# EAGLE design reload (EAGLE 6.4)
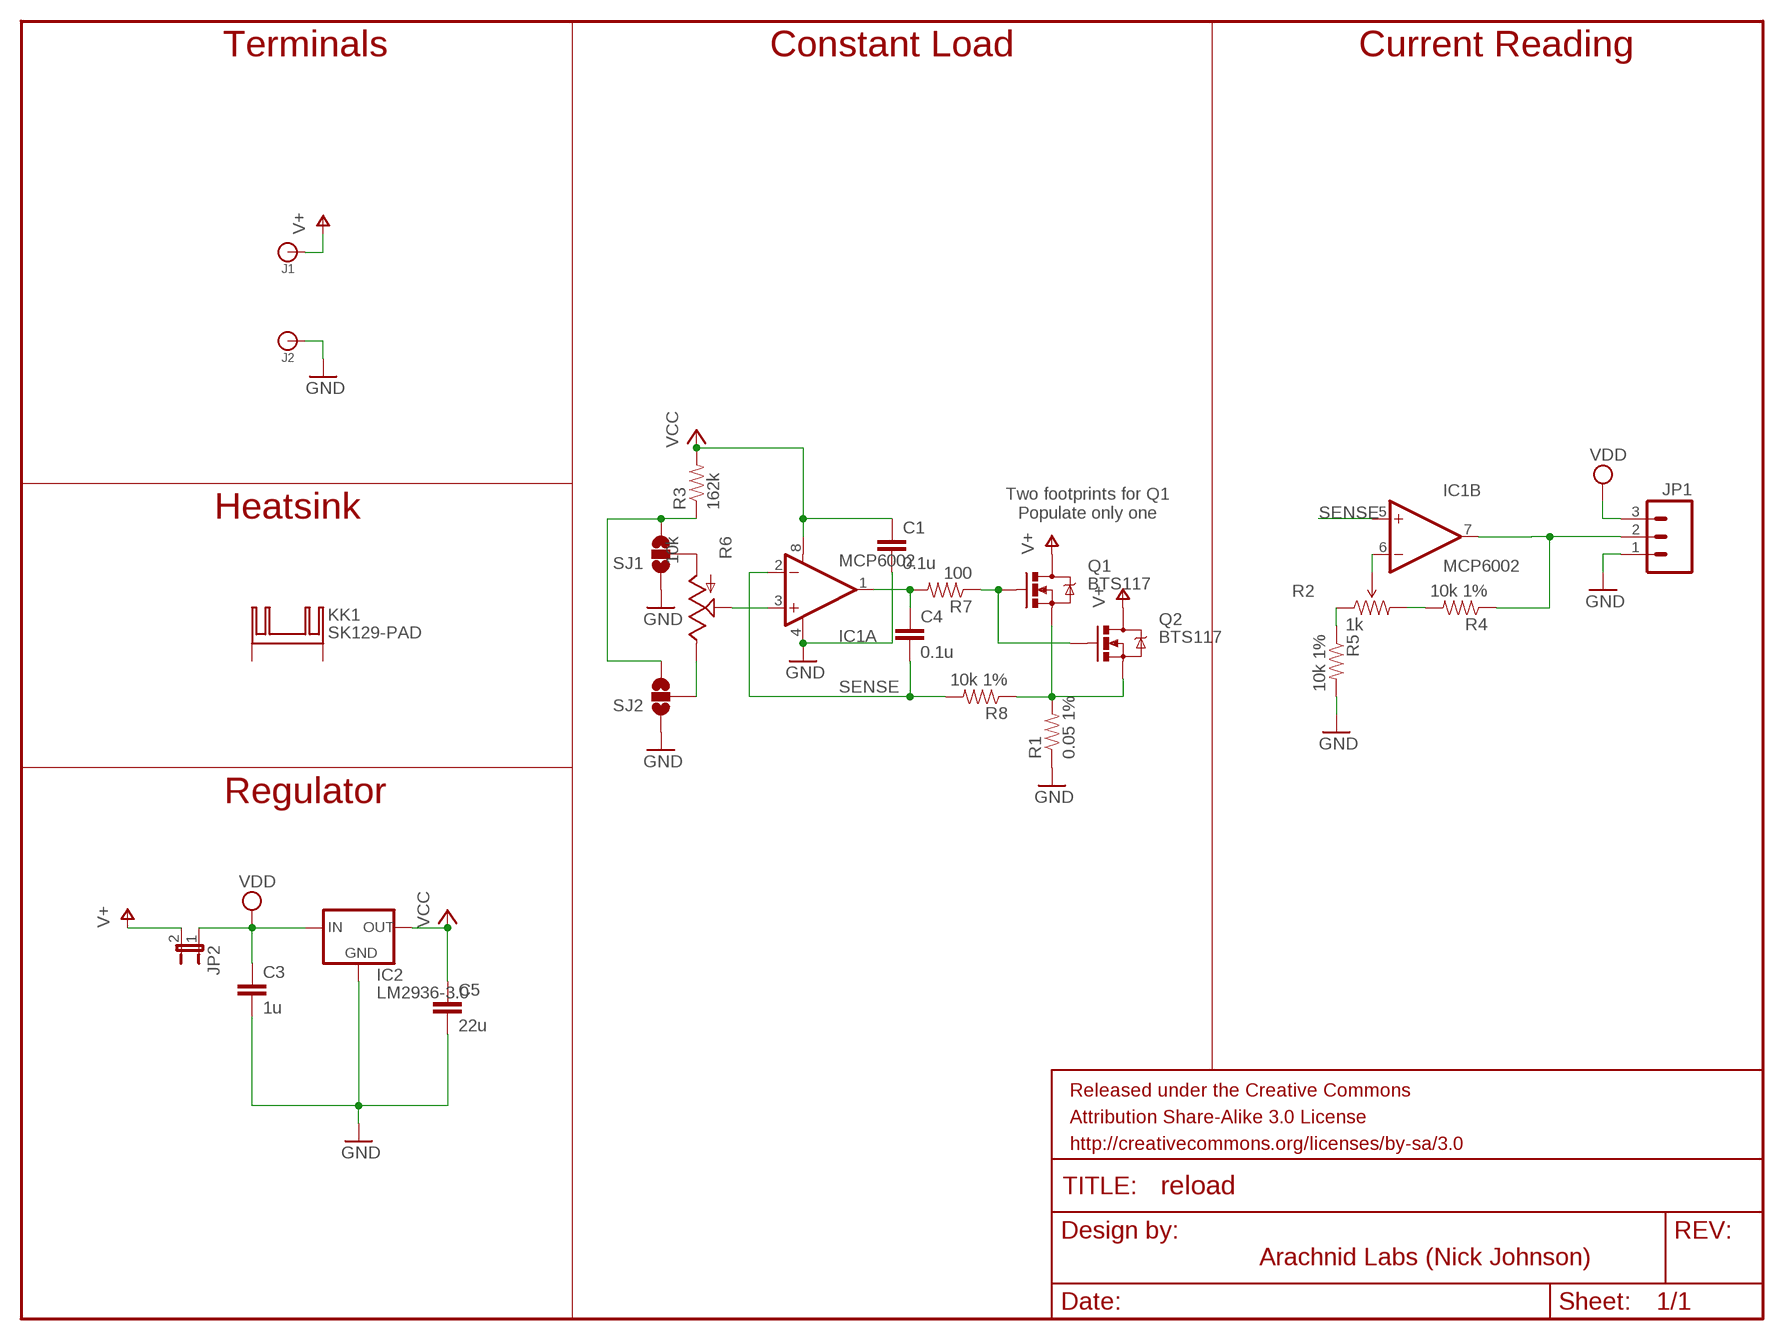
[diagram p0: schematic, sheet 1]

## Parts
C1  0.1u  CAP0805  [0805]
C3  1u  CAP0805  [0805]
C4  0.1u  CAP0805  [0805]
C5  22u  CAP0805  [0805]
IC1  MCP6002  OPAMP-DUALMS  [SOP08]
IC2  LM2936-3.0  V_REG_MIC2920  [SOT223]
J1  BANANA_CONN  [BANANA_CONN]
J2  BANANA_CONN  [BANANA_CONN]
JP1  M031X03_NO_SILK  [1X03_NO_SILK]
JP2  JUMPER-2SMD-NC  [SJ_2S]
KK1  SK129-PAD  [SK129]
Q1  BTS117  MOSFET-NCHANNELPTH2  [TO220V]
Q2  BTS117  MOSFET-NCHANNELTO220V-NOSILK  [TO220V-NOSILK]
R1  0.05 1%  RESISTOR2512  [R2512]
R2  1k  TRIMPOTEVN5E  [TRIMPOT-EVN5E]
R3  162k  RESISTOR0805-RES  [0805]
R4  10k 1%  RESISTOR0805-RES  [0805]
R5  10k 1%  RESISTOR0805-RES  [0805]
R6  10k  POT  [ALPS_POT]
R7  100  RESISTOR0805-RES  [0805]
R8  10k 1%  RESISTOR0805-RES  [0805]
SJ1  SOLDERJUMPER_2WAYPASTE2&3  [SJ_3_PASTE2&3]
SJ2  SOLDERJUMPER_2WAYPASTE1&2  [SJ_3_PASTE1&2]

## Nets
GND: C1.2 C3.2 C5.2 IC1.4(A:V-) IC2.2(GND) J2.P$1 JP1.1 R1.1 R5.2 SJ1.1 SJ2.1
IREF: IC1.7(B:OUT) JP1.2 R4.1
N$1: C4.1 IC1.1(A:OUT) R7.2
N$2: R6.P$3(A) SJ1.2
N$3: Q1.3(S) Q2.3(S) R1.2 R8.1
N$4: IC1.3(A:+IN) R6.P$2(S)
N$5: IC1.6(B:-IN) R2.2(WIPER)
N$6: R2.1(CCW) R5.1
N$7: R2.3(CW) R4.2
N$8: R6.P$1(E) SJ2.2
N$9: Q1.1(G) Q2.1(G) R7.1
N$10: R3.1 SJ1.3 SJ2.3
SENSE: C4.2 IC1.2(A:-IN) IC1.5(B:+IN) R8.2
V+: J1.P$1 JP2.2 Q1.2(D) Q2.2(D)
VCC: C1.1 C5.1 IC1.8(A:V+) IC2.3(OUT) R3.2
VDD: C3.1 IC2.1(IN) JP1.3 JP2.1
Unconnected: KK1.A2,5(K) KK1.B2,5(K)

## Notes on the sheet
- Terminals | Constant Load | Current Reading
- Heatsink
- Two footprints for Q1
  Populate only one
- Regulator
- Arachnid Labs (Nick Johnson)

## Library data of the parts
C1 C3-C5 = SparkFun-Passives:CAP: Capacitor Standard 0603 ceramic capacitor, and 0.1" leaded capacitor.
IC1 = nickparts:OPAMP-DUAL: Generic op-amp footprint
IC2 = SparkFun-PowerIC:V_REG_MIC2920: MIC2920A (http://www.micrel.com/_PDF/mic2920.pdf) - 400mA output LDO Regulator
J1 J2 = SparkFun-Connectors:BANANA_CONN: Through-hole banana jack
JP1 = SparkFun-Connectors:M03: Header 3 Standard 3-pin 0.1" header. Use with straight break away headers (SKU : PRT-00116), right angle break away headers (PRT-00553), swiss pins (PRT-00743), machine pins (PRT-00117), and female headers (PRT-00115). Molex polarized connector foot print use with SKU : PRT-08232 with associated crimp pins and housings.
JP2 = SparkFun-Passives:JUMPER-2: Jumper Basic 0.1" spaced jumper. Use with breakaway headers.
KK1 = nickparts:SK129-PAD: HEATSINK manufacturer Fischer/distributor Buerklin
Q1 = SparkFun-DiscreteSemi:MOSFET-NCHANNEL: Generic NMOS footprint
Q2 = nickparts:MOSFET-NCHANNEL: Common NMOSFET Parts MFG P/N Store ID Prod ID FDD8780 TRANS-09984 SI7820DN TRANS-11055 FDS6630A IC-08089 2N7002PW TRANS-11151 FQP30N06L COM-10213 TRANS-10060 BSS123LT1G TRANS-08345 BSS138 TRANS-00830 BS170 2N7000
R1 R3-R5 R7 R8 = SparkFun-Passives:RESISTOR: Resistor Basic schematic elements and footprints for 0603, 1206, and PTH resistors.
R2 = nickparts:TRIMPOT: Various small potentiometers for "set-and-forget" applications
R6 = nickparts:POT
SJ1 SJ2 = SparkFun-Passives:SOLDERJUMPER_2WAY: Solder Jumper 2 way solder jumper

## Board
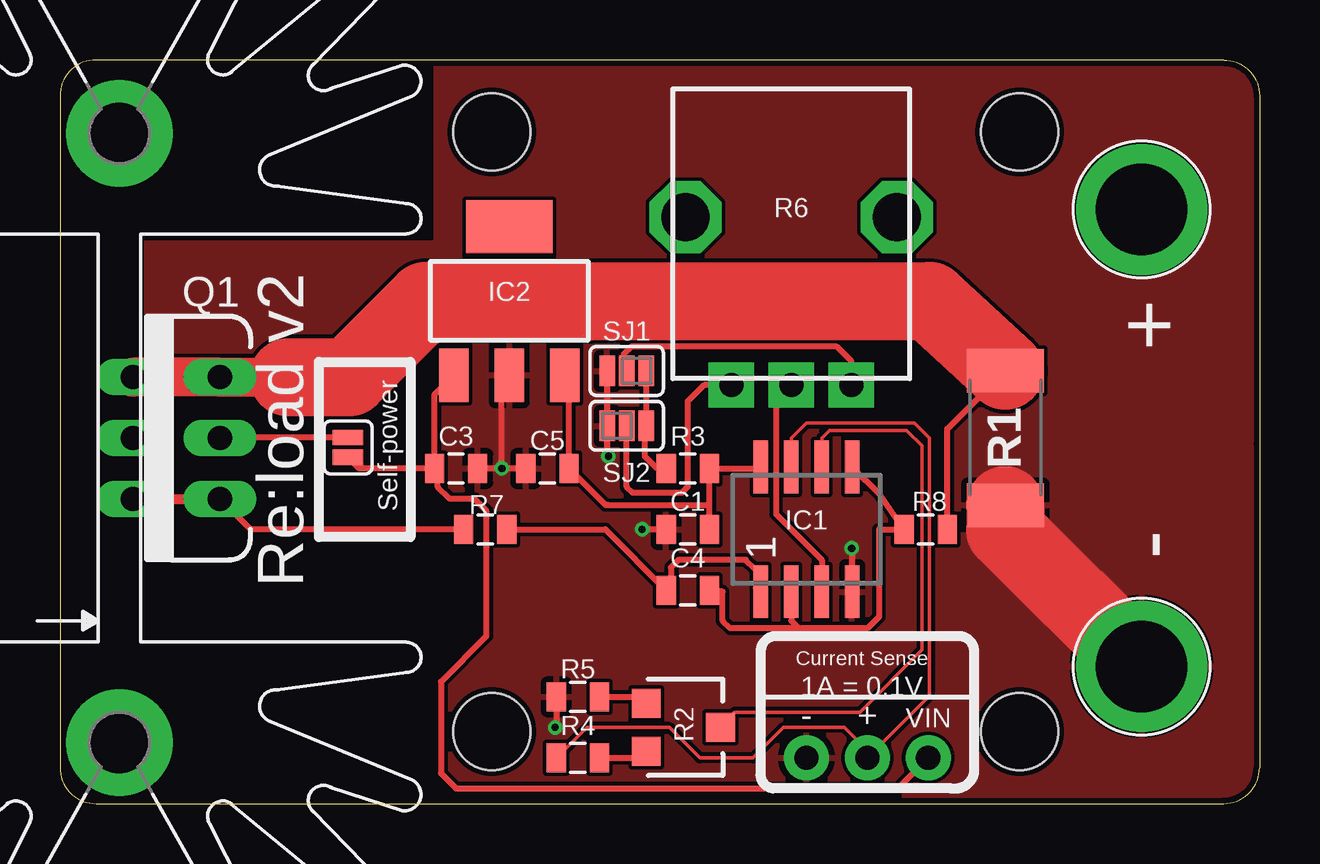
[diagram p1: board, top side]
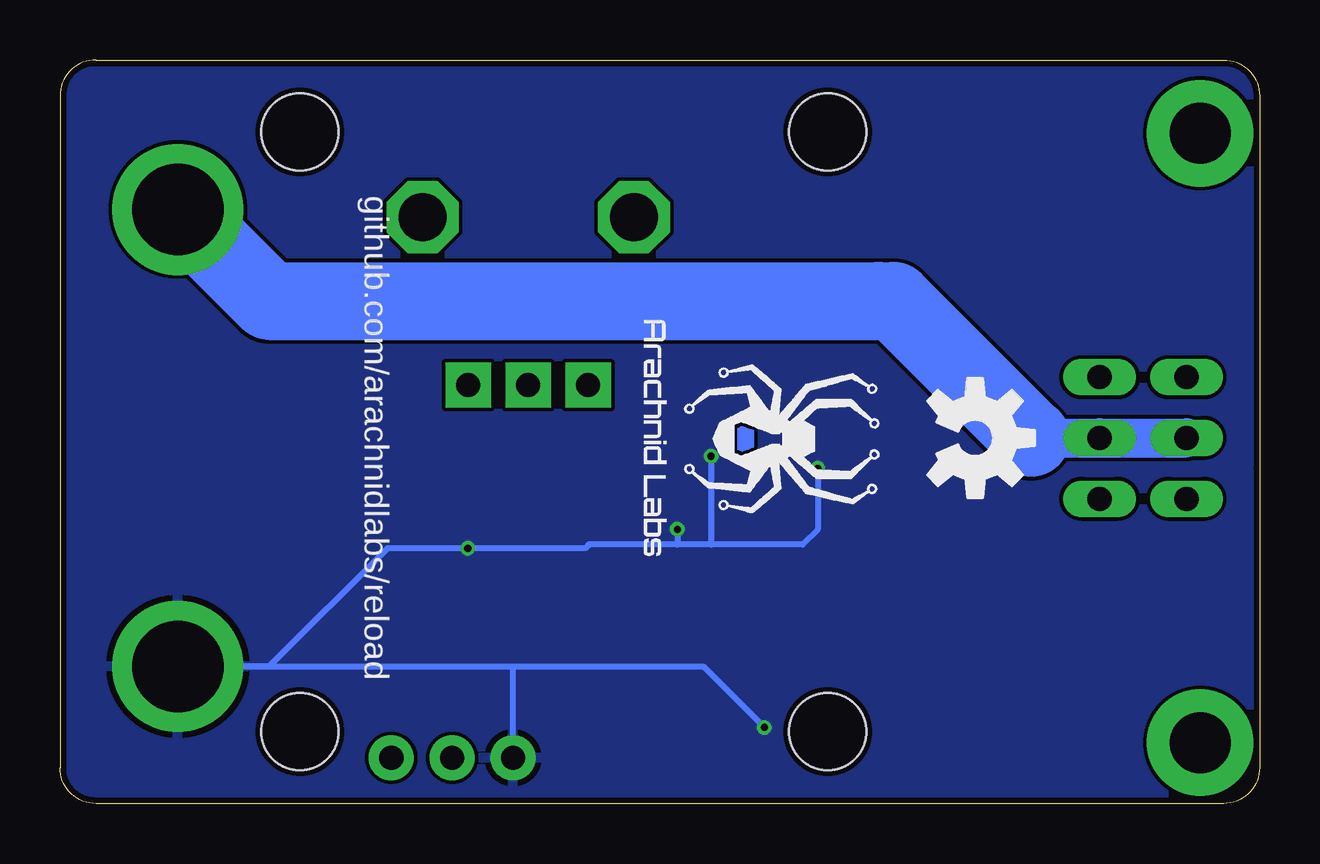
[diagram p2: board, bottom side, seen from below]

Size 50 x 31 mm. Coordinates in mm from the lower left corner, seen from the top.
Outline: 0,1.5 arc90 1.5,0 48.5,0 arc90 50,1.5 50,15 50,29.5 arc90 48.5,31 1.5,31 arc90 0,29.5 0,14 0,1.5
Copper layers (1*16): Top 0.035mm / dielectric 1.5mm / Bottom 0.035mm
Design rules "Fusion_eagle_rule_v1.1 *": minimum track width 6mil, minimum drill 0.3mm, track to track 6mil, track to pad 6mil, pad to pad 6mil, via to via 6mil, smd to smd 0mil, copper to edge 10mil, drill to drill 10mil, minimum pad ring 10mil, minimum via ring 6mil, stop-mask expansion 2mil, vias tented up to drill 100mil, thermal gap 10mil
Holes 3.2 mm at 18,28 18,3 40,28 40,3

### Footprints (pad centres in the part's own frame; a part is rotated, then mirrored left to right if it is on the bottom)
0805 = smd 0.8 x 1.2: 1 -0.9,0; 2 0.9,0
SOP08 = smd 0.6 x 2.2: 1 -1.905,-2.6; 2 -0.635,-2.6; 3 0.635,-2.6; 4 1.905,-2.6; 5 1.905,2.6; 6 0.635,2.6; 7 -0.635,2.6; 8 -1.905,2.6
SOT223 = smd 1.219 x 2.235: 1 -2.311,-3.099; 2 0,-3.099; 3 2.311,-3.099 | smd 3.6 x 2.2: 4 0,3.099
BANANA_CONN = drill 3.81 pad 5.461: P$1 0,0
1X03_NO_SILK = drill 1.016 pad 1.88: 1 0,0; 2 2.54,0; 3 5.08,0
SJ_2S = smd 0.635 x 1.27: 1 -0.412,0; 2 0.412,0
SK129 = drill 2.54 pad 4.445: A2,5 -12.7,-0.889; B2,5 12.7,-0.889
TO220V = drill 1.016 long: 1 -2.54,0; 2 0,0; 3 2.54,0
TO220V-NOSILK = drill 1.016 long: 1 -2.54,0; 2 0,0; 3 2.54,0
R2512 = smd 1.8 x 3.2: 1 -2.8,0; 2 2.8,0
TRIMPOT-EVN5E = smd 1.2 x 1.2: 1 -1,-1.6; 2 0,1.5; 3 1,-1.6
ALPS_POT = drill 1 pad 1.88 square: P$1 7,-2.5; P$2 7,0; P$3 7,2.5 | drill 2 octagon: P$4 0,-4.4; P$5 0,4.4
SJ_3_PASTE2&3 = smd 0.635 x 1.27: 1 -0.813,0; 2 0,0; 3 0.813,0
SJ_3_PASTE1&2 = smd 0.635 x 1.27: 1 -0.813,0; 2 0,0; 3 0.813,0

### Placement (x,y rotation side)
C1  26.17,11.43 180 top
C3  16.51,13.97 0 top
C4  26.17,8.89 0 top
C5  20.32,13.97 180 top
IC1  31.11,11.43 0 top
IC2  18.73,20.95 0 top
J1  45.09,24.77 0 top
J2  45.09,5.71 0 top
JP1  31.11,1.91 0 top
JP2  12.01,14.85 90 top
KK1  1.59,15.24 90 top
Q1  6.67,15.24 90 top
Q2  3.05,15.24 90 top
R1  39.4,15.24 90 top
R2  26.04,3.17 270 top
R3  26.17,13.97 0 top
R4  21.59,1.91 0 top
R5  21.59,4.45 180 top
R6  30.48,24.45 270 top
R7  17.73,11.43 0 top
R8  36.08,11.43 180 top
SJ1  23.62,18.03 0 top
SJ2  23.62,15.75 0 top
U$2  [ARACHNID_LABS_LOGO_SM]  20.75,15.24 270 bottom
U$3  [OSHW-LOGO-M]  11.86,15.24 270 bottom

### Tracks (layer width: path | path; a pad name or v marks a point on that pad's centre or on a via)
GND  (via drill 0.3)
  Top 0.254: 33.02,9.68 IC1.4 33,8.98 v33,10.64 | R5.2 20.69,3.23 v20.64,3.17 | v18.41,13.97 C3.2 | C5.2 v18.41,13.97 | C1.2 v24.27,11.43 | 22.86,17.78 22.75,17.89 SJ1.1 SJ2.1 22.81,14.53 v22.86,14.48 | v18.41,13.97 18.41,17.54 IC2.2
  Top 3.251: R1.1 39.41,11.39 J2.P$1
  Bottom 0.254: 31.11,5.71 J2.P$1 41.27,5.71 36.35,10.64 v33,10.64 28.1,10.64 27.98,10.76 27.98,10.79 24.27,10.79 | 31.11,5.71 23.18,5.71 v20.64,3.17 | JP1.1 31.11,5.71 | v18.41,13.97 18.41,11.43 19.05,10.79 22.86,10.79 | 22.86,10.79 24.27,10.79 | v24.27,11.43 24.27,10.79 | v22.86,14.48 22.86,10.79
  pour Bottom: 0,31 49,31 arc-90 50,30 50,0 0.41,0 arc-90 0,0.41
  pour Top: 0,0 50,0 50,31 0,31
IREF
  Top 0.152: IC1.7 30.48,15.24 31.11,15.88 35.61,15.88 36.24,15.24 36.24,4.49 JP1.2 33.66,2.22 32.7,3.17 30.16,3.17 28.89,1.91 26.67,1.91 25.4,3.17 21.96,3.17 R4.1
N$1
  Top 0.254: IC1.1 29,8.98 29,9.73 28.57,10.16 25.79,10.16 25.47,9.84 25.47,8.94 C4.1 22.73,11.43 R7.2
N$2
  Top 0.254: R6.P$3 32.98,18.45 32.7,18.73 32.38,19.05 23.81,19.05 23.5,18.73 23.5,18.07 SJ1.2
N$3
  Top 0.254: R8.1 36.98,15.62 R1.2
  Top 1.626: 9.53,17.78 Q1.3 Q2.3
  Top 3.251: 9.53,17.78 12.06,17.78 15.24,20.95 36.24,20.95 R1.2
N$4
  Top 0.254: R6.P$2 30.48,17.14 29.84,16.51 29.84,12.06 31.75,10.16 IC1.3
N$5
  Top 0.152: 27.73,3.17 R2.2 28.12,3.81 33.34,3.81 35.92,6.4 35.92,14.92 35.29,15.56 32.07,15.56 31.75,15.24 IC1.6
N$6
  Top 0.254: 24.66,4.33 R2.1 23.96,4.45 R5.1
N$7
  Top 0.254: R2.3 24.66,2.33 | 24.32,2.22 R2.3 | R4.2 23.96,1.91 R2.3
N$8
  Top 0.254: R6.P$1 26.85,17.45 26.16,16.76 26.16,13.21 25.91,12.95 23.88,12.95 23.62,13.21 23.62,15.7 SJ2.2
N$9
  Top 0.254: R7.1 7.94,11.43 Q1.1
  Top 0.406: Q2.1 Q1.1
N$10
  Top 0.254: SJ1.3 SJ2.3 24.38,15.75 24.38,14.48 24.89,13.97 R3.1
SENSE
  Top 0.254: IC1.5 34.18,12.88 R8.2 34.14,11.44 34.14,7.79 33.66,7.3 30.8,7.3 | 30.8,7.3 27.94,7.3 27.62,7.62 27.62,8.84 C4.2 | IC1.2 30.48,7.62 30.8,7.3
V+
  Top 0.254: JP2.2 6.68,15.26 Q1.2
  Bottom 0.254: 16.19,20.64 15.88,20.95
  Bottom 1.626: 9.53,15.24 Q1.2 Q2.2
  Bottom 3.251: J1.P$1 41.27,20.95 15.88,20.95 15.24,20.95 9.53,15.24
VCC
  Top 0.254: C1.1 27.07,12.45 | 27.07,12.45 R3.2 29.13,13.97 IC1.8 | IC2.3 21.22,17.36 C5.1 22.74,12.45 22.86,12.45 27.07,12.45
  Top 0.406: IC2.3 20.63,17.9
VDD
  Top 0.254: JP1.3 34.92,0.64 16.51,0.64 15.88,1.27 15.88,5.08 17.78,6.99 17.78,12.19 17.27,12.7 16.26,12.7 15.75,13.21 15.75,13.83 C3.1 | C3.1 12.47,13.97 JP2.1 | C3.1 15.61,17.05 IC2.1
  Top 0.406: IC2.1 16.46,17.9

### Text on the board
tNames: + | Re:load v2 | Self-power | - | Current Sense | 1A = 0.1V | - | + | VIN
bNames: github.com/arachnidlabs/reload